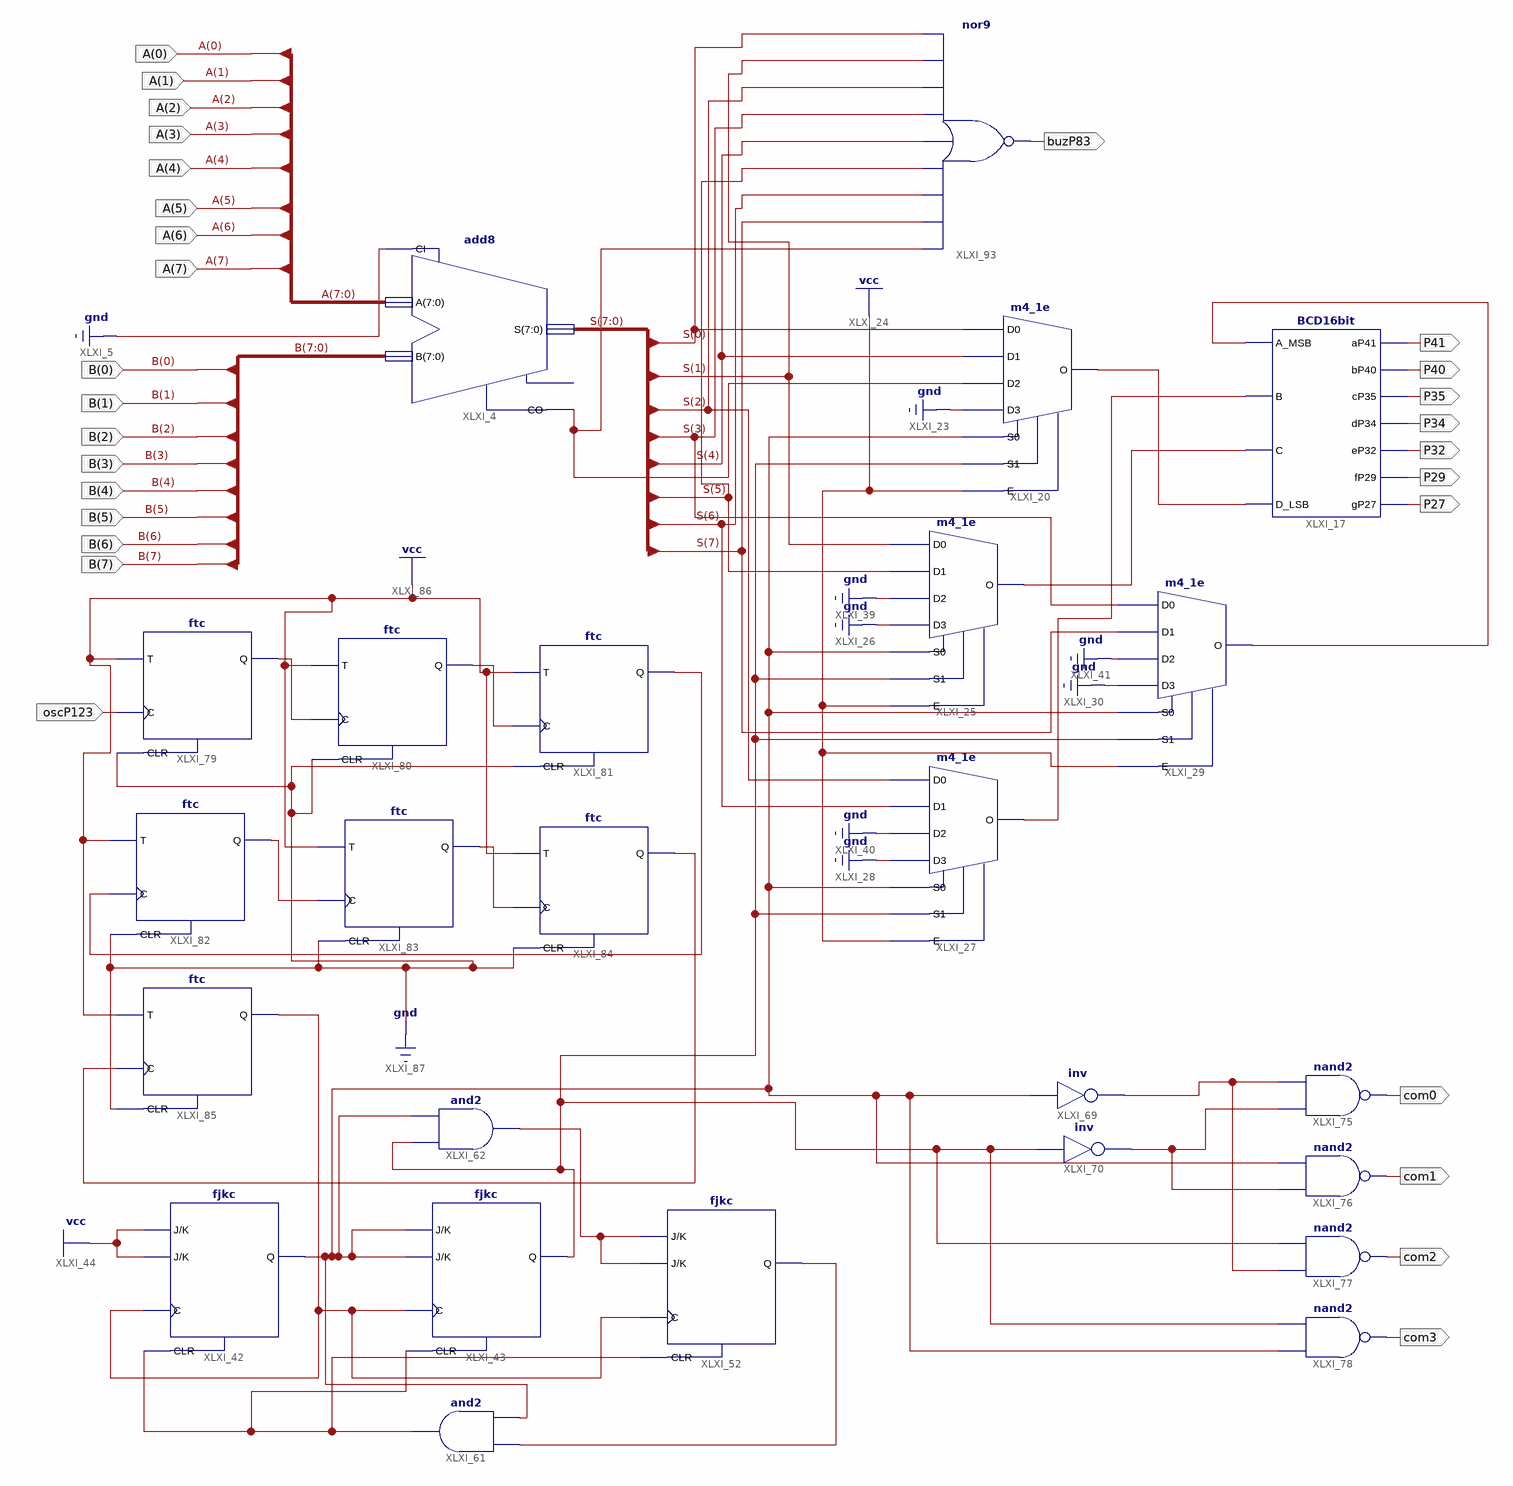
[diagram p0: schematic sheet 1]
// Xilinx ISE schematic lab8.sch (spartan6) as structural Verilog: 25 symbols, 29 ports
module lab8 (
  input  [7:0] A,
  input  [7:0] B,
  input  oscP123,
  output P41,
  output P40,
  output P35,
  output P34,
  output P32,
  output P29,
  output P27,
  output com0,
  output com1,
  output com2,
  output com3,
  output buzP83
);

  wire XLXN_76, XLXN_91, XLXN_112, XLXN_113, XLXN_114, XLXN_132, XLXN_136, XLXN_137, XLXN_150, XLXN_153,
       XLXN_154, XLXN_155, XLXN_166, XLXN_167, XLXN_168, XLXN_169, XLXN_170, XLXN_171, XLXN_172;
  wire [7:0] S;

  add8 XLXI_4 (.A(A), .B(B), .CI(1'b0), .CO(XLXN_76), .S(S));  // open: OFL
  m4_1e XLXI_20 (.D0(S[0]), .D1(S[4]), .D2(XLXN_76), .D3(1'b0), .E(1'b1), .S0(XLXN_155), .S1(XLXN_154), .O(XLXN_114));
  BCD16bit XLXI_17 (
    .A_MSB(XLXN_91), .C(XLXN_112), .aP41(P41), .bP40(P40), .cP35(P35), .dP34(P34), .eP32(P32), .fP29(P29),
    .gP27(P27), .D_LSB(XLXN_114), .B(XLXN_113));
  m4_1e XLXI_25 (.D0(S[1]), .D1(S[5]), .D2(1'b0), .D3(1'b0), .E(1'b1), .S0(XLXN_155), .S1(XLXN_154), .O(XLXN_112));
  m4_1e XLXI_29 (.D0(S[3]), .D1(S[7]), .D2(1'b0), .D3(1'b0), .E(1'b1), .S0(XLXN_155), .S1(XLXN_154), .O(XLXN_91));
  m4_1e XLXI_27 (.D0(S[2]), .D1(S[6]), .D2(1'b0), .D3(1'b0), .E(1'b1), .S0(XLXN_155), .S1(XLXN_154), .O(XLXN_113));
  fjkc XLXI_42 (.C(XLXN_172), .CLR(XLXN_137), .J(1'b1), .K(1'b1), .Q(XLXN_155));
  fjkc XLXI_43 (.C(XLXN_172), .CLR(XLXN_137), .J(XLXN_155), .K(XLXN_155), .Q(XLXN_154));
  fjkc XLXI_52 (.C(XLXN_172), .CLR(XLXN_137), .J(XLXN_136), .K(XLXN_136), .Q(XLXN_132));
  and XLXI_61 (XLXN_137, XLXN_155, XLXN_132);
  and XLXI_62 (XLXN_136, XLXN_154, XLXN_155);
  not XLXI_69 (XLXN_153, XLXN_155);
  not XLXI_70 (XLXN_150, XLXN_154);
  nand XLXI_75 (com0, XLXN_150, XLXN_153);
  nand XLXI_76 (com1, XLXN_150, XLXN_155);
  nand XLXI_77 (com2, XLXN_153, XLXN_154);
  nand XLXI_78 (com3, XLXN_155, XLXN_154);
  ftc XLXI_79 (.C(oscP123), .CLR(1'b0), .T(1'b1), .Q(XLXN_166));
  ftc XLXI_80 (.C(XLXN_166), .CLR(1'b0), .T(1'b1), .Q(XLXN_167));
  ftc XLXI_81 (.C(XLXN_167), .CLR(1'b0), .T(1'b1), .Q(XLXN_168));
  ftc XLXI_82 (.C(XLXN_168), .CLR(1'b0), .T(1'b1), .Q(XLXN_169));
  ftc XLXI_83 (.C(XLXN_169), .CLR(1'b0), .T(1'b1), .Q(XLXN_170));
  ftc XLXI_84 (.C(XLXN_170), .CLR(1'b0), .T(1'b1), .Q(XLXN_171));
  ftc XLXI_85 (.C(XLXN_171), .CLR(1'b0), .T(1'b1), .Q(XLXN_172));
  nor XLXI_93 (buzP83, XLXN_76, S[7], S[6], S[5], S[4], S[3], S[2], S[1], S[0]);
endmodule
